# EAGLE design LB-w17-XOR-v03(1_2) (EAGLE 6.6.0)
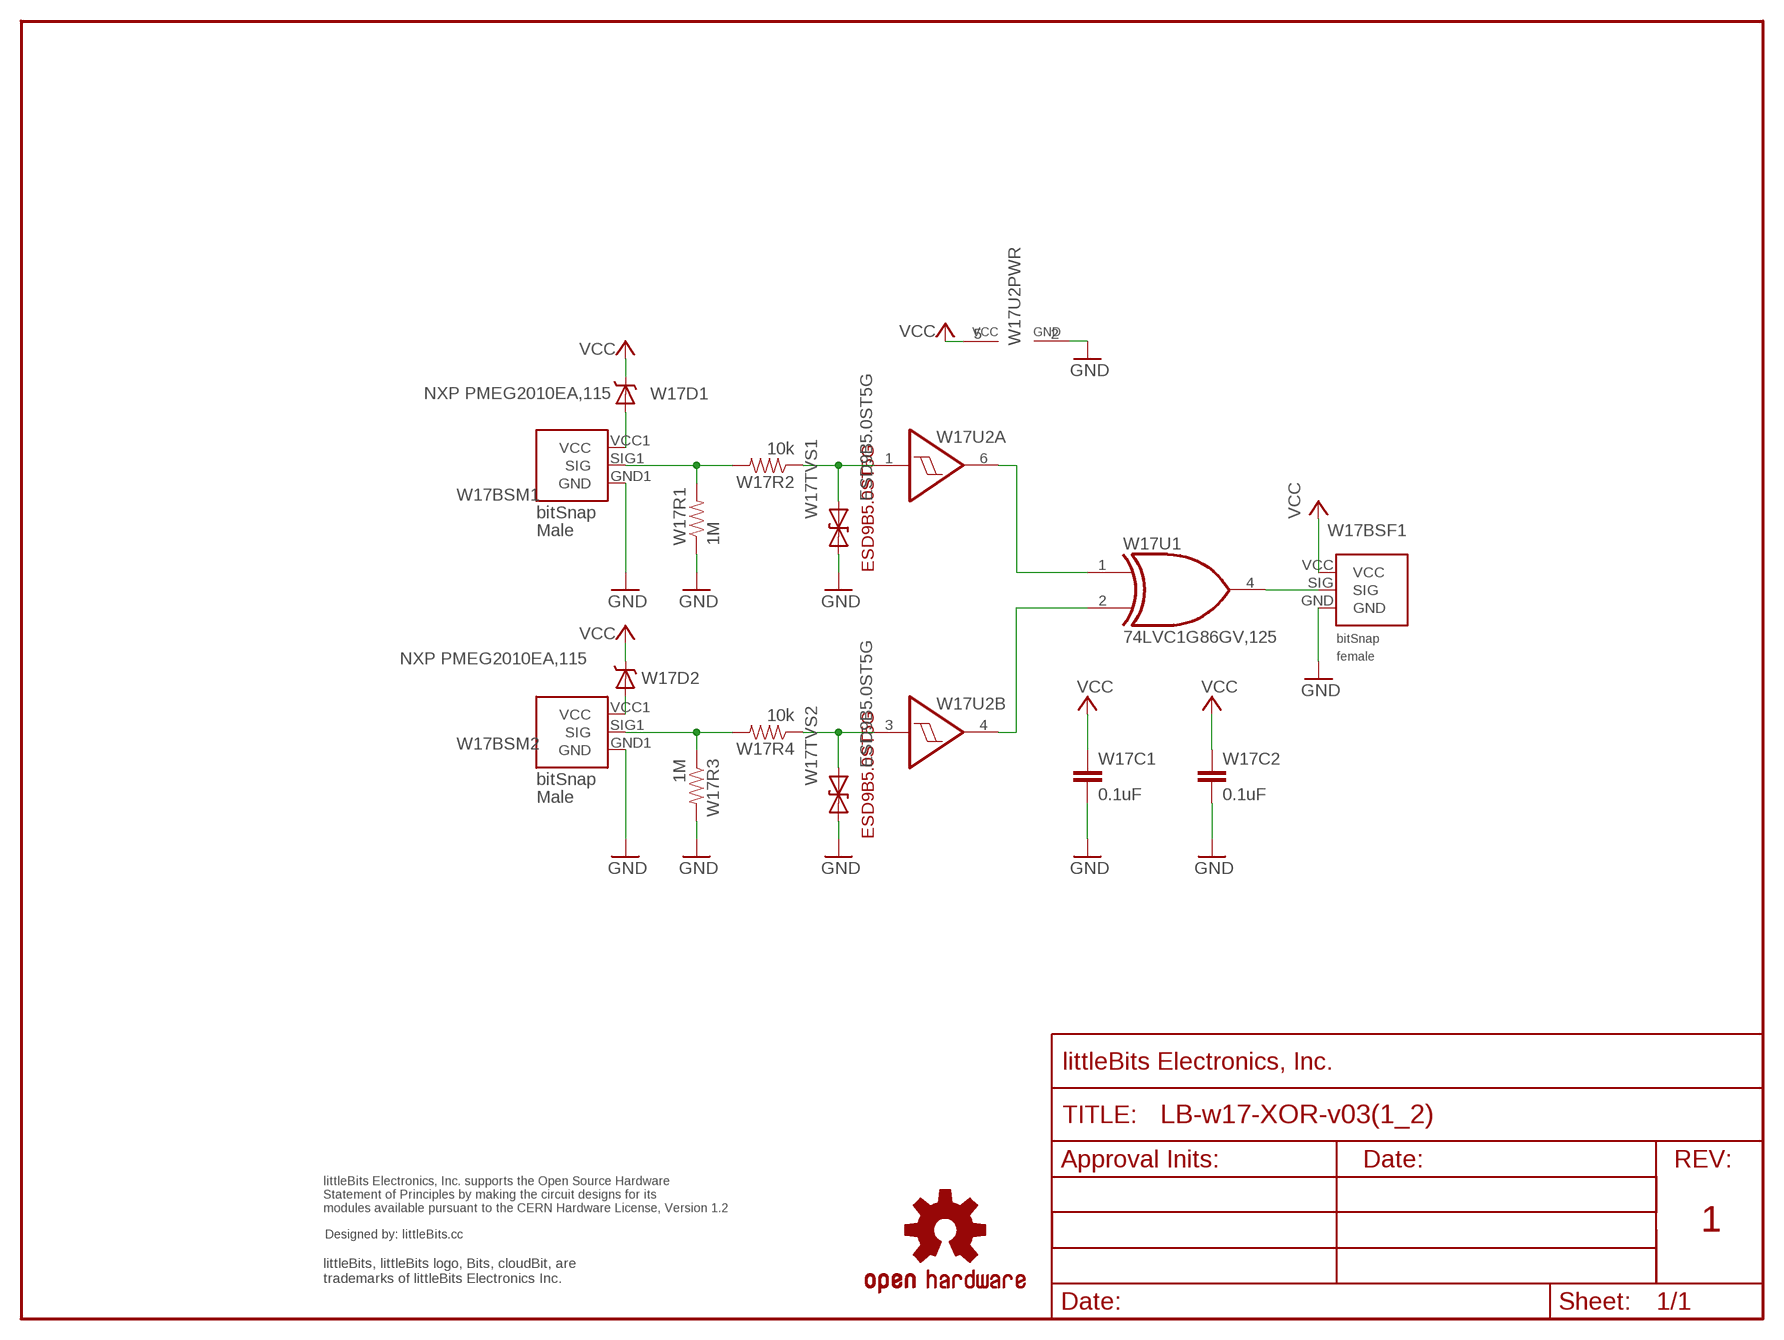
[diagram p0: schematic, sheet 1]

## Parts
U$1  FRAME-LETTER-OHWOHW  [FABDWG01-OHW]
U$2  OSHW-LOGOL  [OSHW-LOGO-L]
U$5  OSHWCREDIT  [OSHWCREDIT]
W17BSF1  BITSNAP_V03_FEMALE  [BITSNAP_V03_FEMALE]
W17BSM1  BITSNAP_V03_MALE  [BITSNAP_V03_MALE]
W17BSM2  BITSNAP_V03_MALE  [BITSNAP_V03_MALE]
W17C1  0.1uF  CAPCAP-0603  [CAP-0603]
W17C2  0.1uF  CAPCAP-0603  [CAP-0603]
W17D1  NXP PMEG2010EA,115  DIODE-SCHOTTKY  [SOD-323]
W17D2  NXP PMEG2010EA,115  DIODE-SCHOTTKY  [SOD-323]
W17R1  1M  RESISTOR0603-RES  [0603-RES]
W17R2  10k  RESISTOR0603-RES  [0603-RES]
W17R3  1M  RESISTOR0603-RES  [0603-RES]
W17R4  10k  RESISTOR0603-RES  [0603-RES]
W17TVS1  ESD9B5.0ST5G  DIODE-TVSSOD-923  [SOD-923]
W17TVS2  ESD9B5.0ST5G  DIODE-TVSSOD-923  [SOD-923]
W17U1  74LVC1G86GV,125  74AHC1G86DBV  [SOT23-5]
W17U2  NC7WZ17P6X  SCHMITT_TRIGGER_NON_INVERTINGNC7WZ17  [SC70-6]

## Nets
GND: W17BSF1.GND W17BSM1.GND1(GND) W17BSM2.GND1(GND) W17C1.2 W17C2.2 W17R1.1 W17R3.2 W17TVS1.1(A) W17TVS2.1(A) W17U2.2(PWR:GND)
N$1: W17BSM2.SIG1(SIG) W17R3.1 W17R4.2
N$2: W17U1.1(I0) W17U2.6(A:O)
N$3: W17BSM1.VCC1(VCC) W17D1.2(A)
N$4: W17U1.2(I1) W17U2.4(B:O)
N$5: W17BSM2.VCC1(VCC) W17D2.2(A)
N$6: W17BSM1.SIG1(SIG) W17R1.2 W17R2.2
N$7: W17R2.1 W17TVS1.2(C) W17U2.1(A:I)
N$8: W17R4.1 W17TVS2.2(C) W17U2.3(B:I)
N$9: W17BSF1.SIG W17U1.4(O)
VCC: W17BSF1.VCC W17C1.1 W17C2.1 W17D1.1(C) W17D2.1(C) W17U2.5(PWR:VCC)

## Notes on the sheet
- 1

## Power pins joined to a net without a drawn wire
GND: W17U1.3(GND)
VCC: W17U1.5(VCC)

## Library data of the parts
U$1 = LITTLEBITS:FRAME-LETTER-OHW
U$2 = SparkFun_NEW:OSHW-LOGO: Open Source Hardware Logo This logo indicates the piece of hardware it is found on incorporates a OSHW license and/or adheres to the definition of open source hardware found here: http://freedomdefined.org/OSHW
U$5 = LITTLEBITS:OSHWCREDIT
W17BSF1 = bitSnap:BITSNAP_V03_FEMALE
W17BSM1 W17BSM2 = bitSnap:BITSNAP_V03_MALE
W17C1 W17C2 = LITTLEBITS:CAP
W17D1 W17D2 = LITTLEBITS:DIODE-SCHOTTKY
W17R1-W17R4 = SparkFun:RESISTOR: Resistor Basic schematic elements and footprints for 0603, 1206, and PTH 1/10th watt (small) resistors.
W17TVS1 W17TVS2 = LITTLEBITS:DIODE-TVS: Bidirectional Transient Voltage Suppression Diode: Device conducts in avalanche mode after reaching a part dependent voltage threshold. Used for limiting voltage spikes on ESD sensitive inputs and outputs.; IEC_ESD_PROT0: +/-18kV; LB_PN: ?; MPN: ESD9B5.0ST5G; V_CLAMP: ?; V_OPERATION: 5V
W17U1 = 74xx-little-us:74*1G86: 2-input EXCLUSIV-OR gate
W17U2 = LITTLEBITS:SCHMITT_TRIGGER_NON_INVERTING

## Board
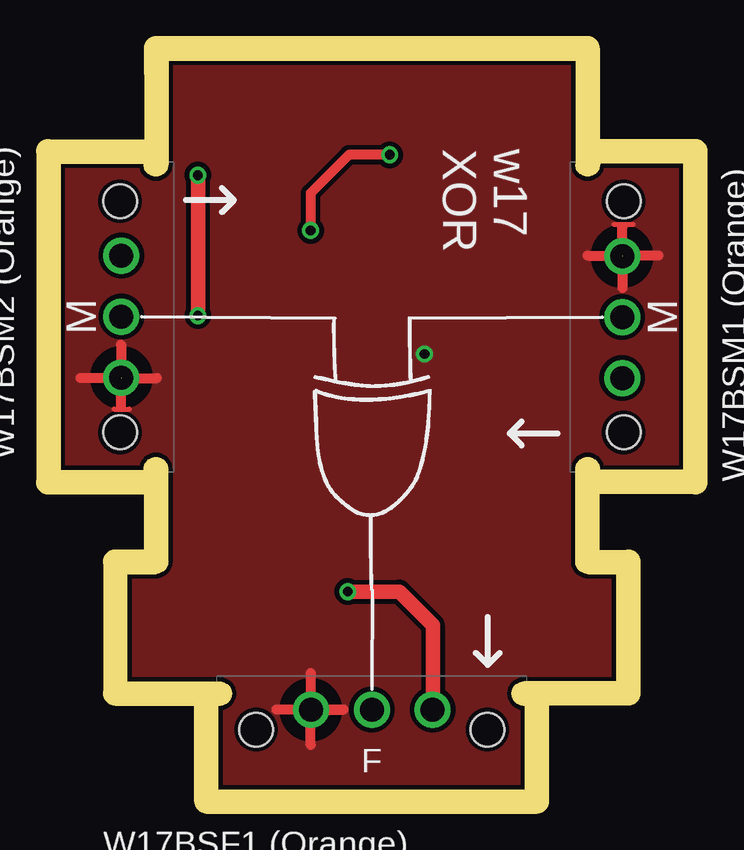
[diagram p1: board, top side]
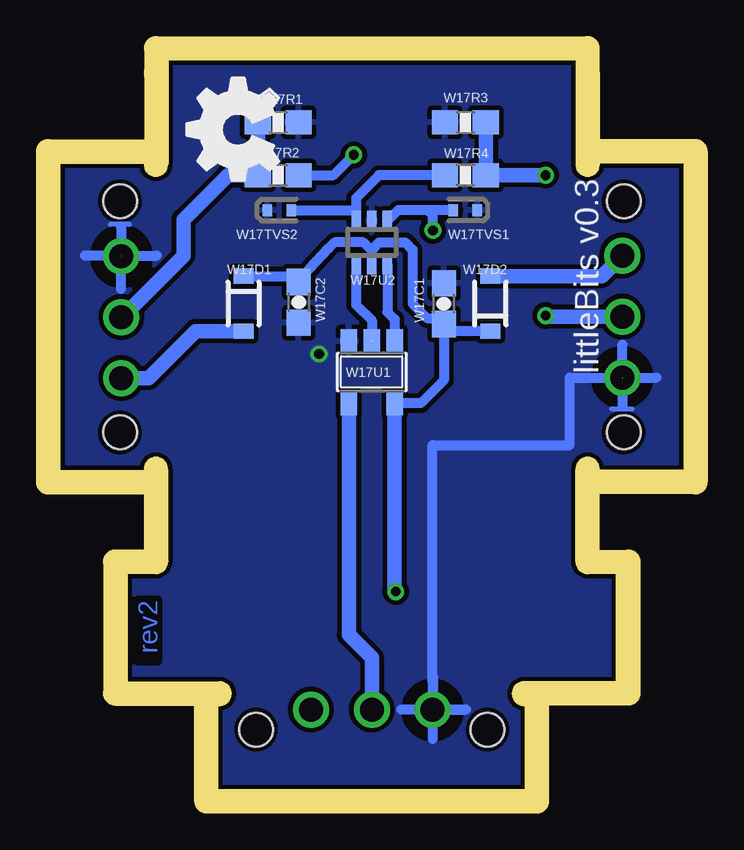
[diagram p2: board, bottom side, seen from below]

Size 26 x 30.4 mm. Coordinates in mm from the lower left corner, seen from the top.
Outline: 2.8,4.5 2.8,9 4,9 arc90 4.5,9.5 4.5,9.51
Outline: 23.2,4.5 23.2,9 22,9 arc-90 21.5,9.5 21.5,9.51
Outline: 4.5,29.9 4.5,30.4 21.5,30.4 21.5,29.9
Copper layers (1*16): Top 0.035mm / dielectric 1.5mm / Bottom 0.035mm
Design rules "littleBitsDRC": minimum track width 0.2mm, minimum drill 0.4mm, track to track 0.2mm, track to pad 0.2mm, pad to pad 0.2mm, via to via 0.2mm, smd to smd 0mil, copper to edge 0.2mm, drill to drill 0.2mm, minimum pad ring 0.2mm, minimum via ring 0.15mm, stop-mask expansion 0.1mm, vias tented up to drill 0mil, thermal gap 0.2mm
tRestrict: area 9.4,2.2 to 11.6,4.4; area 1.5,16.1 to 3.7,18.3; area 22.3,21.1 to 24.5,23.3
bRestrict: area 9.4,2.2 to 11.6,4.4; area 22.3,21.1 to 24.5,23.3; area 1.5,16.1 to 3.7,18.3
Milling: 9 lines

### Footprints (pad centres in the part's own frame; a part is rotated, then mirrored left to right if it is on the bottom)
BITSNAP_V03_FEMALE = drill 1: GND 3.91,3.33; SIG 6.45,3.33; VCC 8.99,3.33 | hole 1.4: 1.63,2.5; 11.27,2.5
BITSNAP_V03_MALE = drill 1: GND1 8.98,2.56; SIG1 6.44,2.56; VCC1 3.9,2.56 | hole 1.4: 11.27,2.5; 1.63,2.5
CAP-0603 = smd 1.1 x 1: 1 -0.85,0; 2 0.85,0
SOD-323 = smd 0.63 x 0.83: 1 -1.15,0; 2 1.15,0
0603-RES = smd 1.1 x 1: 1 -0.85,0; 2 0.85,0
SOD-923 = smd 0.4 x 0.5: 1 -0.5,0; 2 0.5,0
SOT23-5 = smd 0.69 x 0.99: 1 -0.95,-1.29; 2 0,-1.29; 3 0.95,-1.29; 4 0.95,1.3; 5 -0.95,1.3
SC70-6 = smd 0.4 x 0.85: 1 -0.65,-0.9; 2 0,-0.9; 3 0.65,-0.9; 4 0.65,0.9; 5 0,0.9; 6 -0.65,0.9

### Placement (x,y rotation side)
U$1  -2.2,0 0 top
U$2  -32.32,-66.26 0 top  (outside the outline)
U$4  [XOR_IMAGE]  10.55,19.7 270 top
U$5  -93.1,-61.35 0 top  (outside the outline)
U$6  [OSHW_FILLX150_NOTEXT]  16.9,24.55 0 top
W17BSF1  6.55,0 0 top
W17BSM1  26,13.25 90 top
W17BSM2  0,26.15 270 top
W17C1  10,20.25 90 bottom
W17C2  16.05,20.3 270 bottom
W17D1  18.35,20.25 270 bottom
W17D2  8.05,20.25 90 bottom
W17R1  16.9,27.8 180 bottom
W17R2  16.9,25.6 180 bottom
W17R3  9.1,27.8 180 bottom
W17R4  9.1,25.6 0 bottom
W17TVS1  9.1,24.15 180 bottom
W17TVS2  16.85,24.15 0 bottom
W17U1  13,17.4 180 bottom
W17U2  13,22.8 180 bottom

### Tracks (layer width: path | path; a pad name or v marks a point on that pad's centre or on a via)
GND  (via drill 0.41)  (2 unrouted)
  Top 0.203: 23.1,23.55 23.9,23.55 | 2.25,15.85 2.9,15.85
  Top 0.406: 10.45,4.85 W17BSF1.GND | 10.45,1.85 W17BSF1.GND | W17BSF1.GND 11.83,3.33 9.02,3.33 | 22,22.25 23.45,22.25 | 24.95,22.25 23.45,22.25 | 23.45,22.25 23.45,23.45 | 23.45,22.25 23.45,20.9 | 2.55,18.55 2.55,17.15 | 2.55,16 2.55,17.15 | 2.55,17.15 4.05,17.15 | 2.55,17.15 0.85,17.15
  Bottom 0.203: 23.1,23.55 23.9,23.55 | 2.15,15.85 3,15.85
  Bottom 0.406: W17C1.2 9.75,21.1 9.75,21.25 | W17BSF1.GND 10.45,4.75 10.46,4.5 | 10.45,2.1 W17BSF1.GND | W17BSF1.GND 9.27,3.33 9.07,3.33 11.77,3.33 | 2.55,17.15 2.53,17.17 | 2.53,17.17 1.13,17.17 | 2.53,17.17 W17BSM2.GND1 | W17BSM2.GND1 4.75,17.17 4.75,14.35 10.46,14.35 10.46,4.5 | W17BSM2.GND1 2.55,16 | W17BSM2.GND1 2.55,18.55 | 10.46,4.5 W17BSF1.GND | 23.45,23.45 23.45,22.25 | 23.45,20.85 23.45,22.25 | 23.45,22.25 24.95,22.25 | 23.45,22.25 21.95,22.25
  other vias: 15.2,18.15
  pour Bottom: 0.12,30.25 25.9,30.25 25.7,0.22 0.27,0.27
  pour Top: 0,0 26,0 26,30.4 0,30.4
N$1  (via drill 0.41)
  Top 0.61: v5.75,19.75 v5.75,25.6
  Bottom 0.61: W17R3.1 W17R4.2 v5.75,25.6 | W17BSM2.SIG1 5.71,19.71 v5.75,19.75
N$2
  Bottom 0.406: W17U2.6 12.35,19.9 12.05,19.6 W17U1.1
N$3
  Bottom 0.61: W17D1.2 20.35,19.1 22.3,17.15 W17BSM1.VCC1
N$4
  Bottom 0.406: W17U2.4 13.65,20.2 13,19.55 W17U1.2
N$5
  Bottom 0.61: W17D2.2 3.41,21.4 W17BSM2.VCC1
N$6
  Bottom 0.61: W17R1.2 W17R2.2 19,25.6 20.85,23.75 20.85,22.25 23.41,19.69 W17BSM1.SIG1
N$7  (via drill 0.41)
  Top 0.406: v13.75,26.45 12.05,26.45 10.45,24.85 v10.45,23.3
  Bottom 0.406: W17TVS1.2 10.65,24.15 | 10.65,24.15 11.9,24.15 W17U2.1 | W17R2.1 14.6,25.6 v13.75,26.45 | v10.45,23.3 10.45,23.95 10.65,24.15
N$8
  Bottom 0.406: W17TVS2.2 13.65,24.15 | W17R4.1 12.7,25.6 13.65,24.65 13.65,24.15 | 13.65,24.15 W17U2.3
N$9
  Bottom 0.61: W17U1.4 13.95,6.45 13,5.5 W17BSF1.SIG
VCC  (via drill 0.41)
  Top 0.61: v12,8.25 14.15,8.25 15.55,6.85 W17BSF1.VCC
  Bottom 0.406: W17D1.1 16.05,21.4 W17C2.1 16.1,21.2 15.6,21.7 14.8,22.55 14.55,22.8 13.35,22.8 13,22.45 W17U2.5 13,22.5 12.7,22.8 11.6,22.8 11.3,22.5 11.3,20.25 10.7,19.65 10.25,19.65 W17C1.1 | W17D2.1 9.7,19.1 W17C1.1 | W17C1.1 10,17.05 10.95,16.1 W17U1.5
  Bottom 0.61: W17U1.5 12.05,8.3 v12,8.25

### Text on the board
Bottom: rev2
tPlace: w17 / XOR
bPlace: littleBits v0.3
tNames: W17BSM1 (Orange) | W17BSM2 (Orange) | W17BSF1 (Orange)
Milling: 1mm DIA. ROUTER PATH
Reference: LARGE
dxf: 2 | Exclusive OR Bit